# Altium project GOTO Equatorial.PrjPcb
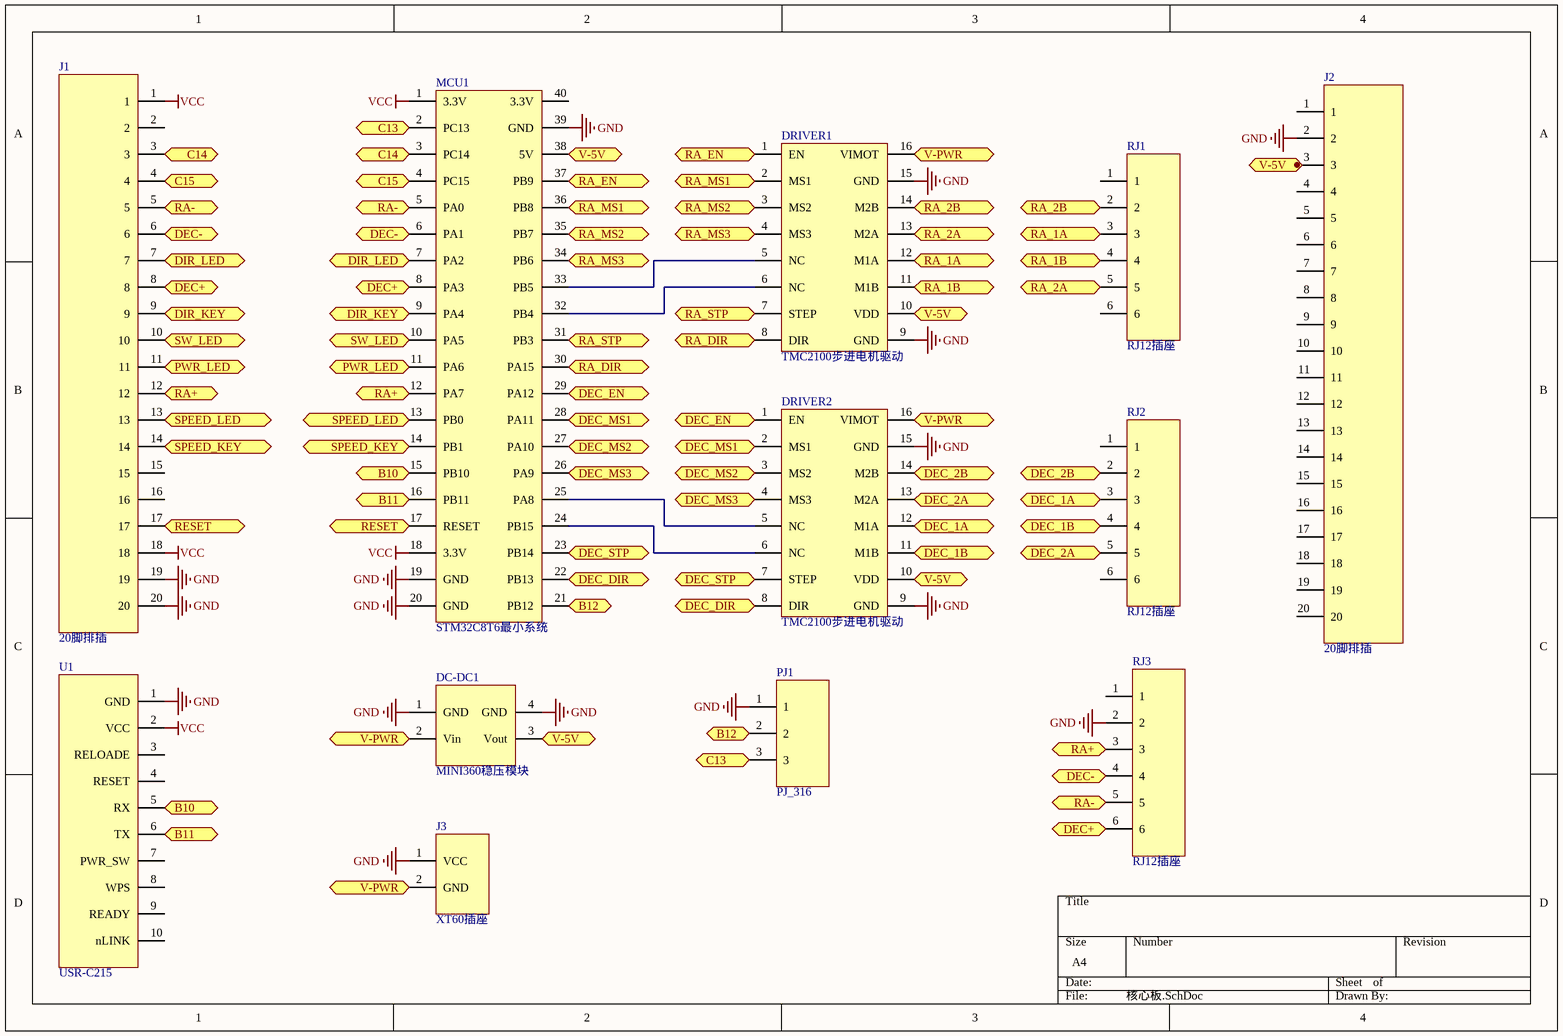
[diagram p0: 核心板.SchDoc]
2 sheets, 27 parts. Net scope: flat (ports and power ports of the same name join across sheets).
Board files: 核心板.PcbDoc, 按键板.PcbDoc
Sheets:
  核心板.SchDoc
  按键板.SchDoc

## Sheet 核心板.SchDoc
size A4

### Parts
DC-DC1  MINI360稳压模块  [mini360]
DRIVER1  TMC2100步进电机驱动  [DIP16]
DRIVER2  TMC2100步进电机驱动  [DIP16]
J1  20脚排插  [SIP20]
J2  20脚排插  [SIP20]
J3  XT60插座
MCU1  STM32C8T6最小系统  [DIP40]
PJ1  PJ_316  [PJ_316]
RJ1  RJ12插座  [RJ12]
RJ2  RJ12插座  [RJ12]
RJ3  RJ12插座  [RJ12]
U1  USR-C215  [USR_C215]

### Ports
B10, B11, B12, C13, C14, C15, DEC+, DEC-, DEC_1A, DEC_1B, DEC_2A, DEC_2B, DEC_DIR, DEC_EN, DEC_MS1, DEC_MS2, DEC_MS3, DEC_STP, DIR_KEY, DIR_LED, PWR_LED, RA+, RA-, RA_1A, RA_1B, RA_2A, RA_2B, RA_DIR, RA_EN, RA_MS1, RA_MS2, RA_MS3, RA_STP, RESET, SPEED_KEY, SPEED_LED, SW_LED, V-5V, V-PWR

### Nets
GND: DC-DC1.1(GND) DC-DC1.4(GND) DRIVER1.9(GND) DRIVER1.15(GND) DRIVER2.9(GND) DRIVER2.15(GND) J1.19 J1.20 J2.2 J3.1(VCC) MCU1.19(GND) MCU1.20(GND) MCU1.39(GND) PJ1.1 RJ3.2 U1.1(GND)
VCC: J1.1 J1.18 MCU1.1(3.3V) MCU1.18(3.3V) U1.2(VCC)
NetDC-DC1_2: DC-DC1.2(Vin) DRIVER1.16(VIMOT) DRIVER2.16(VIMOT) J3.2(GND) ; port V-PWR
NetDC-DC1_3: DC-DC1.3(Vout) DRIVER1.10(VDD) DRIVER2.10(VDD) MCU1.38(5V) ; port V-5V
NetDRIVER1_1: DRIVER1.1(EN) MCU1.37(PB9) ; port RA_EN
NetDRIVER1_2: DRIVER1.2(MS1) MCU1.36(PB8) ; port RA_MS1
NetDRIVER1_3: DRIVER1.3(MS2) MCU1.35(PB7) ; port RA_MS2
NetDRIVER1_4: DRIVER1.4(MS3) MCU1.34(PB6) ; port RA_MS3
NetDRIVER1_5: DRIVER1.5(NC) MCU1.33(PB5)
NetDRIVER1_6: DRIVER1.6(NC) MCU1.32(PB4)
NetDRIVER1_7: DRIVER1.7(STEP) MCU1.31(PB3) ; port RA_STP
NetDRIVER1_8: DRIVER1.8(DIR) MCU1.30(PA15) ; port RA_DIR
NetDRIVER1_11: DRIVER1.11(M1B) RJ1.4 ; port RA_1B
NetDRIVER1_12: DRIVER1.12(M1A) RJ1.3 ; port RA_1A
NetDRIVER1_13: DRIVER1.13(M2A) RJ1.5 ; port RA_2A
NetDRIVER1_14: DRIVER1.14(M2B) RJ1.2 ; port RA_2B
NetDRIVER2_1: DRIVER2.1(EN) MCU1.29(PA12) ; port DEC_EN
NetDRIVER2_2: DRIVER2.2(MS1) MCU1.28(PA11) ; port DEC_MS1
NetDRIVER2_3: DRIVER2.3(MS2) MCU1.27(PA10) ; port DEC_MS2
NetDRIVER2_4: DRIVER2.4(MS3) MCU1.26(PA9) ; port DEC_MS3
NetDRIVER2_5: DRIVER2.5(NC) MCU1.25(PA8)
NetDRIVER2_6: DRIVER2.6(NC) MCU1.24(PB15)
NetDRIVER2_7: DRIVER2.7(STEP) MCU1.23(PB14) ; port DEC_STP
NetDRIVER2_8: DRIVER2.8(DIR) MCU1.22(PB13) ; port DEC_DIR
NetDRIVER2_11: DRIVER2.11(M1B) RJ2.4 ; port DEC_1B
NetDRIVER2_12: DRIVER2.12(M1A) RJ2.3 ; port DEC_1A
NetDRIVER2_13: DRIVER2.13(M2A) RJ2.5 ; port DEC_2A
NetDRIVER2_14: DRIVER2.14(M2B) RJ2.2 ; port DEC_2B
NetJ1_3: J1.3 MCU1.3(PC14) ; port C14
NetJ1_4: J1.4 MCU1.4(PC15) ; port C15
NetJ1_5: J1.5 MCU1.5(PA0) RJ3.5 ; port RA-
NetJ1_6: J1.6 MCU1.6(PA1) RJ3.4 ; port DEC-
NetJ1_7: J1.7 MCU1.7(PA2) ; port DIR_LED
NetJ1_8: J1.8 MCU1.8(PA3) RJ3.6 ; port DEC+
NetJ1_9: J1.9 MCU1.9(PA4) ; port DIR_KEY
NetJ1_10: J1.10 MCU1.10(PA5) ; port SW_LED
NetJ1_11: J1.11 MCU1.11(PA6) ; port PWR_LED
NetJ1_12: J1.12 MCU1.12(PA7) RJ3.3 ; port RA+
NetJ1_13: J1.13 MCU1.13(PB0) ; port SPEED_LED
NetJ1_14: J1.14 MCU1.14(PB1) ; port SPEED_KEY
NetJ1_17: J1.17 MCU1.17(RESET) ; port RESET
NetMCU1_2: MCU1.2(PC13) PJ1.3 ; port C13
NetMCU1_15: MCU1.15(PB10) U1.5(RX) ; port B10
NetMCU1_16: MCU1.16(PB11) U1.6(TX) ; port B11
NetMCU1_21: MCU1.21(PB12) PJ1.2 ; port B12

Not connected (* = marked no-connect by the designer): J1 2 15 16; J2 1 3 4 5 6 7 8 9 10 11 12 13 14 15 16 17 18 19 20; MCU1 40(3.3V); RJ1 1 6; RJ2 1 6; RJ3 1; U1 3(RELOADE) 4(RESET) 7(PWR_SW) 8(WPS) 9(READY) 10(nLINK)

## Sheet 按键板.SchDoc
size A4
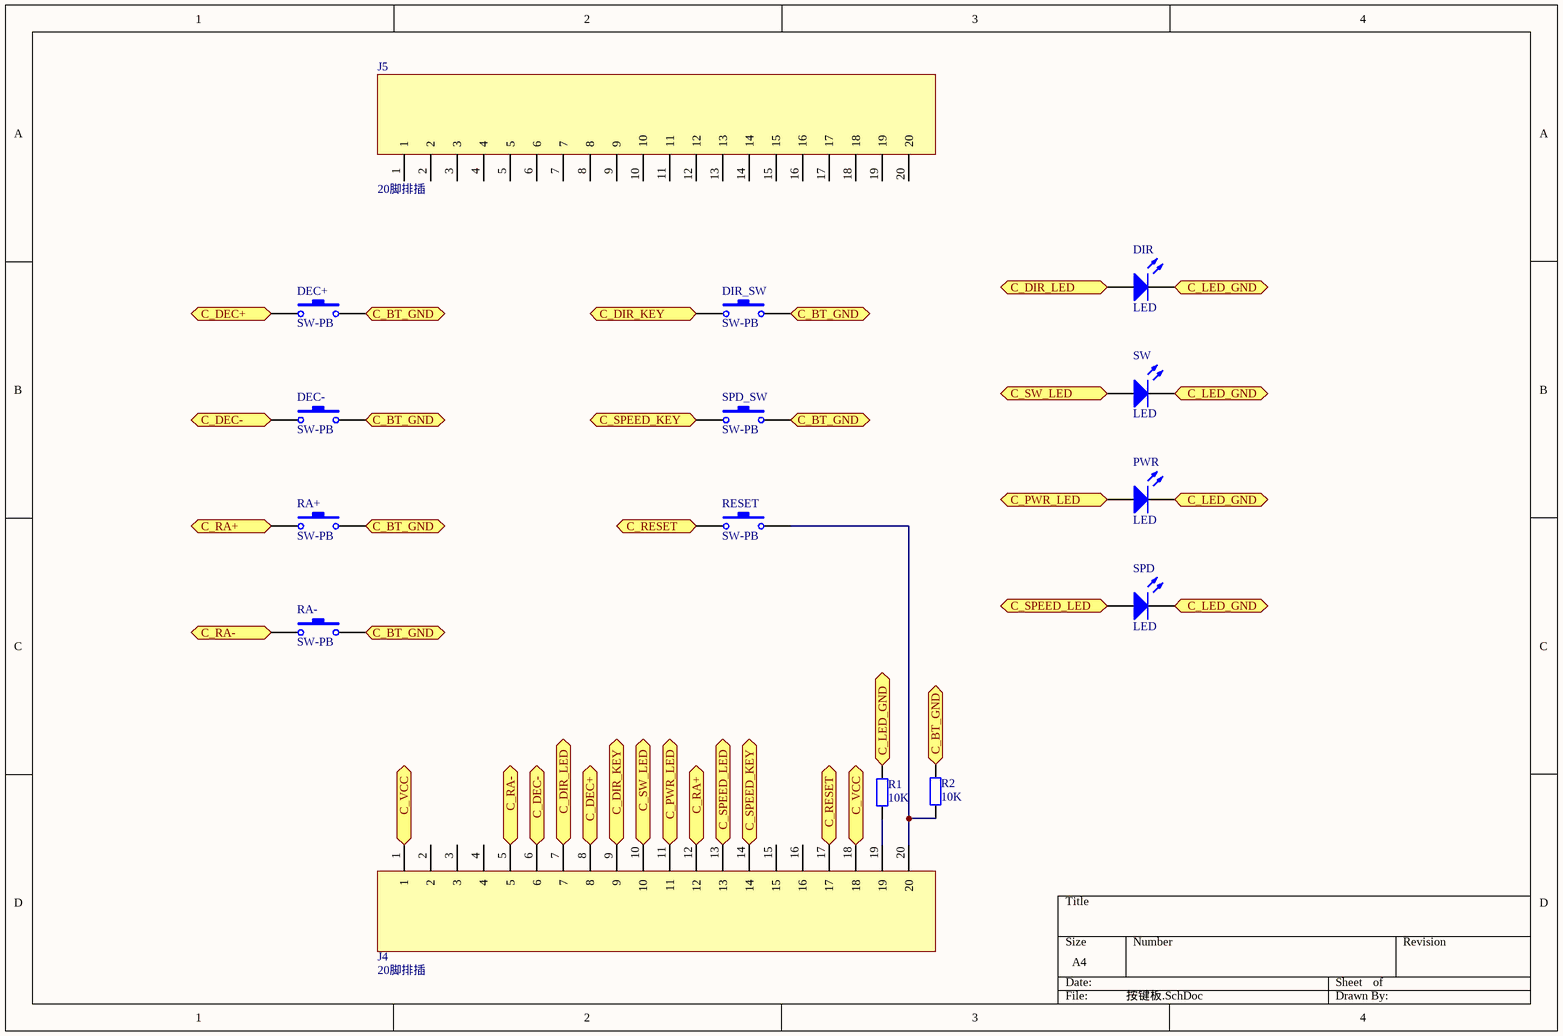
[diagram p1: 按键板.SchDoc]

### Parts
DEC+  SW-PB  [KEY]
DEC-  SW-PB  [KEY]
DIR  LED  [LED]
DIR_SW  SW-PB  [KEY]
J4  20脚排插  [SIP20]
J5  20脚排插  [SIP20]
PWR  LED  [LED]
R1  10K  [resistance]
R2  10K  [resistance]
RA+  SW-PB  [KEY]
RA-  SW-PB  [KEY]
RESET  SW-PB  [KEY]
SPD  LED  [LED]
SPD_SW  SW-PB  [KEY]
SW  LED  [LED]

### Ports
C_BT_GND, C_DEC+, C_DEC-, C_DIR_KEY, C_DIR_LED, C_LED_GND, C_PWR_LED, C_RA+, C_RA-, C_RESET, C_SPEED_KEY, C_SPEED_LED, C_SW_LED, C_VCC

### Nets
NetDEC+_1: DEC+.1 J4.8 ; port C_DEC+
NetDEC+_2: DEC+.2 DEC-.2 DIR_SW.2 R2.1 RA+.2 RA-.2 SPD_SW.2 ; port C_BT_GND
NetDEC-_1: DEC-.1 J4.6 ; port C_DEC-
NetDIR_1: DIR.1(A) J4.7 ; port C_DIR_LED
NetDIR_2: DIR.2(K) PWR.2(K) R1.1 SPD.2(K) SW.2(K) ; port C_LED_GND
NetDIR_SW_1: DIR_SW.1 J4.9 ; port C_DIR_KEY
NetJ4_1: J4.1 J4.18 ; port C_VCC
NetJ4_5: J4.5 RA-.1 ; port C_RA-
NetJ4_10: J4.10 SW.1(A) ; port C_SW_LED
NetJ4_11: J4.11 PWR.1(A) ; port C_PWR_LED
NetJ4_12: J4.12 RA+.1 ; port C_RA+
NetJ4_13: J4.13 SPD.1(A) ; port C_SPEED_LED
NetJ4_14: J4.14 SPD_SW.1 ; port C_SPEED_KEY
NetJ4_17: J4.17 RESET.1 ; port C_RESET
NetJ4_19: J4.19 R1.2
NetJ4_20: J4.20 R2.2 RESET.2

Not connected (* = marked no-connect by the designer): J4 2 3 4 15 16; J5 1 2 3 4 5 6 7 8 9 10 11 12 13 14 15 16 17 18 19 20

### Library data of the parts
DEC+ DEC- DIR_SW RA+ RA- RESET SPD_SW = SW-PB: Switch; Published: 24-Mar-1999; LatestRevisionDate: 17-Jul-2002; LatestRevisionNote: Re-released for DXP Platform.; PackageReference: SPST-2; Publisher: Altium Limited; PackageDescription: Switch; 2 Leads
DIR PWR SPD SW = LED: Typical INFRARED GaAs LED; Published: 8-Jun-2000; LatestRevisionDate: 08-Jul-2005; LatestRevisionNote: Mech Layer 1 removed.; PackageReference: LED-0; Publisher: Altium Limited; PackageDescription: LED; 2 Leads
R1 R2 = 10K: Resistor; Published: 8-Jun-2000; LatestRevisionDate: 17-Jul-2002; LatestRevisionNote: Re-released for DXP Platform.; PackageReference: AXIAL-0.4; Publisher: Altium Limited; PackageDescription: Axial Device, Thru-Hole; 2 Leads; 0.4 in Pin Spacing